# Altium schematic sheet GPS Connector - LS20031.SchDoc: GPS Connector
size A4; Organization: Altium Limited; Address1: 3 Minna Close; Address2: Belrose; Address3: NSW 2085; Address4: Australia
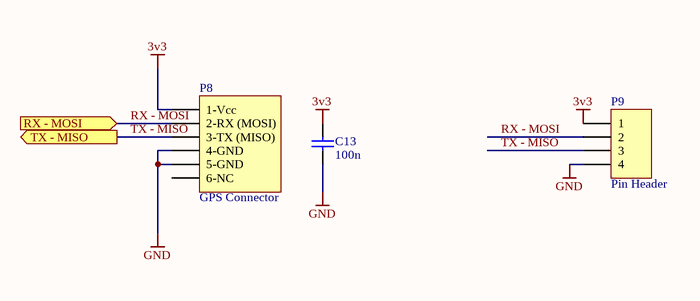
[diagram p0: GPS Connector - LS20031.SchDoc]

## Parts
C13  100n  [C0805]
P8  GPS Connector  [GPScon-BM06B-SRSS-TB]
P9  Pin Header  [PH1x4_2.54]

## Ports
RX - MOSI (in), TX - MISO (out)

## Nets
3v3: C13.2 P8.A1(1-Vcc) P9.1
GND: C13.1 P8.0 P8.A4(4-GND) P8.A5(5-GND) P9.4
RX - MOSI: P8.A2(2-RX_(MOSI)) P9.2 ; port RX - MOSI
TX - MISO: P8.A3(3-TX_(MISO)) P9.3 ; port TX - MISO

Not connected (* = marked no-connect by the designer): P8 A6(6-NC)

## Notes on the sheet
- Disclaimer
  Any design and information, hardware or software  is provided on an "as-is" basis without warranty of any kind and any express or implied warranties, including, but not limited to, the implied warranties of merchantability and fitness for a particular purpose are disclaimed. In no event shall wnpd (or KeaDrone)be liable for any direct, indirect, incidental, special, exemplary, or consequential damages (including, but not limited to, procurement of substitute goods or services; loss of use, data, or profits; or business interruption) however caused and on any theory of liability, whether in contract, strict liability, or tort (including negligence or otherwise) arising in any way out of the use of this firmware, hardware, software or information, even if wnpd (or KeaDrone) has been advised by user of the possibility of such potential loss or damage. The user agrees to hold wnpd (or KeaDrone) harmless from and against any and all claims, losses, liabilities and expenses.
- Title
- Size:
- Date:
- A4
- Name:
- Time:
- Ing. W. Pietersz
- Revision:
- Sheet
- of
- WillyPietersz@gmail.com
- Contact:
- -
- www.wnpd.nl
- File:

## Library data of the parts
C13 = 100n: Tolerance: 0.1; LatestRevision Note: Initial Release; Part Number: 100n; Value: 100n; Package: 0805; Component Type: Standard; LatestRevision Date: 31-7-2010; Author: Willy Pietersz; Supplier 2: Farnell; Supplier Part Number 2: 1759266; ComponentLink1Description: Manufacturer; ComponentLink2Description: Datasheet
P8 = GPS-LS20031: Header, 6-Pin; GPS; 1mm pitch; SMT; SH connector; Crimp; LatestRevisionDate: 17-Jul-2002; LatestRevisionNote: Re-released for DXP Platform.; Publisher: Altium Limited; Part Number: GPS-LS20031; Number Of Pins: 6
P9 = PH1x4: Con1x4; Part Number: PH1x4; Pitch: 2.54; LatestRevision Note: Initial Release; Type: Pin Header; Number Of Pins: 4; Component Type: Standard; LatestRevision Date: 23-11-2010; Author: Willy Pietersz; Supplier 2: Farnell